# EAGLE design CapHat (EAGLE 7.5.0)
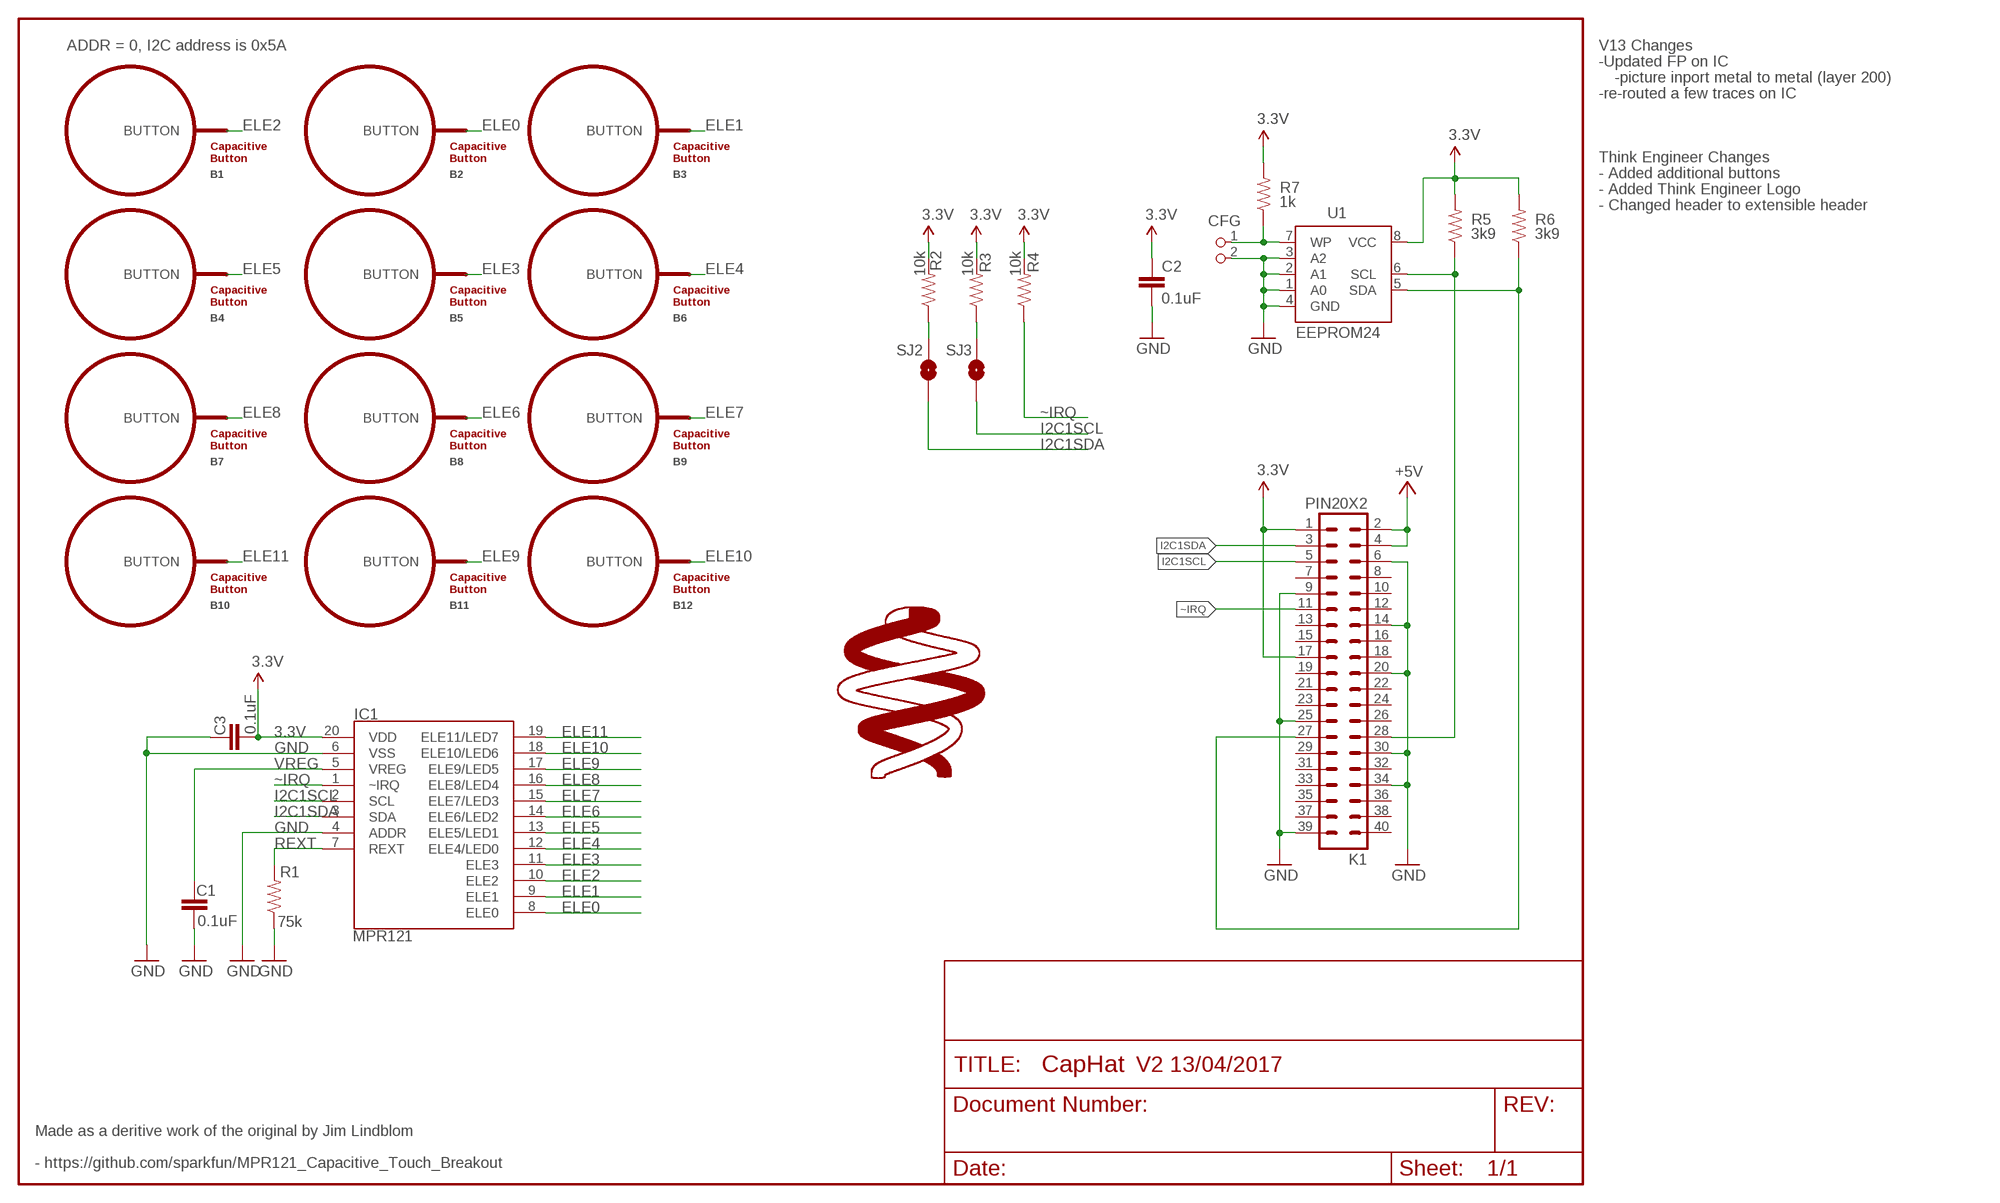
[diagram p0: schematic, sheet 1]

## Parts
B1  BUTTON_PASSIVE10MM  [BUTTON_PASSIVE_10MM]
B2  BUTTON_PASSIVE10MM  [BUTTON_PASSIVE_10MM]
B3  BUTTON_PASSIVE10MM  [BUTTON_PASSIVE_10MM]
B4  BUTTON_PASSIVE10MM  [BUTTON_PASSIVE_10MM]
B5  BUTTON_PASSIVE10MM  [BUTTON_PASSIVE_10MM]
B6  BUTTON_PASSIVE10MM  [BUTTON_PASSIVE_10MM]
B7  BUTTON_PASSIVE10MM  [BUTTON_PASSIVE_10MM]
B8  BUTTON_PASSIVE10MM  [BUTTON_PASSIVE_10MM]
B9  BUTTON_PASSIVE10MM  [BUTTON_PASSIVE_10MM]
B10  BUTTON_PASSIVE10MM  [BUTTON_PASSIVE_10MM]
B11  BUTTON_PASSIVE10MM  [BUTTON_PASSIVE_10MM]
B12  BUTTON_PASSIVE10MM  [BUTTON_PASSIVE_10MM]
C1  0.1uF  CAP0603-CAP  [0603-CAP]
C2  0.1uF  CAP0603-CAP  [0603-CAP]
C3  0.1uF  CAP0603-CAP  [0603-CAP]
CFG  PIN2_100  [PIN_W_2]
IC1  MPR121  MPR121V2  [QFN-20-0.4MM-V2]
K1  PIN20X2  [PIN_20X2]
R1  75k  RESISTOR0603-RES  [0603-RES]
R2  10k  RESISTOR0603-RES  [0603-RES]
R3  10k  RESISTOR0603-RES  [0603-RES]
R4  10k  RESISTOR0603-RES  [0603-RES]
R5  3k9  RESISTOR0603-RES  [0603-RES]
R6  3k9  RESISTOR0603-RES  [0603-RES]
R7  1k  RESISTOR0603-RES  [0603-RES]
SJ2  SOLDERJUMPERNO  [SJ_2S-NO]
SJ3  SOLDERJUMPERNO  [SJ_2S-NO]
U1  EEPROM24  [SOIC8]
U$1  THINK_LOGO  [THINK_LOGO]

## Nets
3.3V: C2.1 C3.2 IC1.20(VDD) K1.1 K1.17 R2.2 R3.2 R4.2 R5.2 R6.2 R7.2 U1.8(VCC)
+5V: K1.2 K1.4
ELE0: B2.BUTTON IC1.8(ELE0)
ELE1: B3.BUTTON IC1.9(ELE1)
ELE2: B1.BUTTON IC1.10(ELE2)
ELE3: B5.BUTTON IC1.11(ELE3)
ELE4: B6.BUTTON IC1.12(ELE4/LED0)
ELE5: B4.BUTTON IC1.13(ELE5/LED1)
ELE6: B8.BUTTON IC1.14(ELE6/LED2)
ELE7: B9.BUTTON IC1.15(ELE7/LED3)
ELE8: B7.BUTTON IC1.16(ELE8/LED4)
ELE9: B11.BUTTON IC1.17(ELE9/LED5)
ELE10: B12.BUTTON IC1.18(ELE10/LED6)
ELE11: B10.BUTTON IC1.19(ELE11/LED7)
GND: C1.2 C2.2 C3.1 CFG.2 IC1.4(ADDR) IC1.6(VSS) K1.6 K1.9 K1.14 K1.20 K1.25 K1.30 K1.34 K1.39 R1.1 U1.1(A0) U1.2(A1) U1.3(A2) U1.4(GND)
I2C1SCL: IC1.2(SCL) K1.5 SJ3.1
I2C1SDA: IC1.3(SDA) K1.3 SJ2.1
N$1: K1.28 R5.1 U1.6(SCL)
N$2: K1.27 R6.1 U1.5(SDA)
N$3: CFG.1 R7.1 U1.7(WP)
REXT: IC1.7(REXT) R1.2
SCL_PU: R3.1 SJ3.2
SDA_PU: R2.1 SJ2.2
VREG: C1.1 IC1.5(VREG)
~IRQ: IC1.1(~IRQ) K1.11 R4.1
Unconnected: K1.7 K1.8 K1.10 K1.12 K1.13 K1.15 K1.16 K1.18 K1.19 K1.21 K1.22 K1.23 K1.24 K1.26 K1.29 K1.31 K1.32 K1.33 K1.35 K1.36 K1.37 K1.38 K1.40

## Notes on the sheet
- ADDR = 0, I2C address is 0x5A | V13 Changes
- -Updated FP on IC
- -picture inport metal to metal (layer 200)
- -re-routed a few traces on IC
- Think Engineer Changes
- - Added additional buttons
- - Added Think Engineer Logo
- - Changed header to extensible header
- V2 13/04/2017
- Made as a deritive work of the original by Jim Lindblom
- - https://github.com/sparkfun/MPR121_Capacitive_Touch_Breakout

## Library data of the parts
B1-B12 = PatternAgents-TouchWidgets:BUTTON_PASSIVE: Button, Passive Capacitive/Touch Sensing Type Source : http://www.PatternAgents.com Github : https://github.com/PatternAgents License : http://creativecommons.org/licenses/by-sa/3.1/ (Creative Commons 3.1) THIS SOFTWARE IS PROVIDED BY THE CONTRIBUTORS "AS IS" AND WITHOUT ANY EXPRESS OR IMPLIED WARRANTIES, INCLUDING, BUT NOT LIMITED TO, THE IMPLIED WARRANTIES OF MERCHANTABILITY AND FITNESS FOR A PARTICULAR PURPOSE ARE DISCLAIMED. IN NO EVENT SHALL THE COPYRIGHT OWNER OR CONTRIBUTORS BE LIABLE FOR ANY DIRECT, INDIRECT, INCIDENTAL, SPECIAL, EXEMPLARY, OR CONSEQUENTIAL DAMAGES (INCLUDING, BUT NOT LIMITED TO, PROCUREMENT OF SUBSTITUTE GOODS OR SERVICES; LOSS OF USE, DATA, OR PROFITS; OR BUSINESS INTERRUPTION) HOWEVER CAUSED AND ON ANY THEORY OF LIABILITY, WHETHER IN CONTRACT, STRICT LIABILITY, OR TORT (INCLUDING NEGLIGENCE OR OTHERWISE) ARISING IN ANY WAY OUT OF THE USE OF THIS SOFTWARE, EVEN IF ADVISED OF THE POSSIBILITY OF SUCH DAMAGE.
C1 C3 = SparkFun-Capacitors:CAP: Capacitor Standard 0603 ceramic capacitor, and 0.1" leaded capacitor.
C2 = SparkFun-Capacitors:CAP: Capacitor Standard 0603 ceramic capacitor, and 0.1" leaded capacitor.; DIELECTRIC: X7R
CFG = FLYFISH:PIN2
IC1 = SparkFun-Sensors:MPR121: MPR121 Capacitive Touch Sensor Controller. Variant "V2" was created using an image import of the bottom of the IC. It matches metal to metal.
K1 = FLYFISH:PIN20X2
R1 = SparkFun-Resistors:RESISTOR: Resistor
R2-R4 = SparkFun:RESISTOR: Resistor
R5-R7 = SparkFun-Resistors:RESISTOR: Resistor; TOLERANCE: 5%
SJ2 SJ3 = SparkFun-Retired:SOLDERJUMPER: Solder Jumper Standard SMD solder jumper. Used to automate production. Two varients : Normally Open and Normally Closed are the same, but have different paste layers. NC will have a large amount of paste and should jumper during reflow.
U1 = FLYFISH:EEPROM24
U$1 = ThinkEngineer:THINK_LOGO

## Board
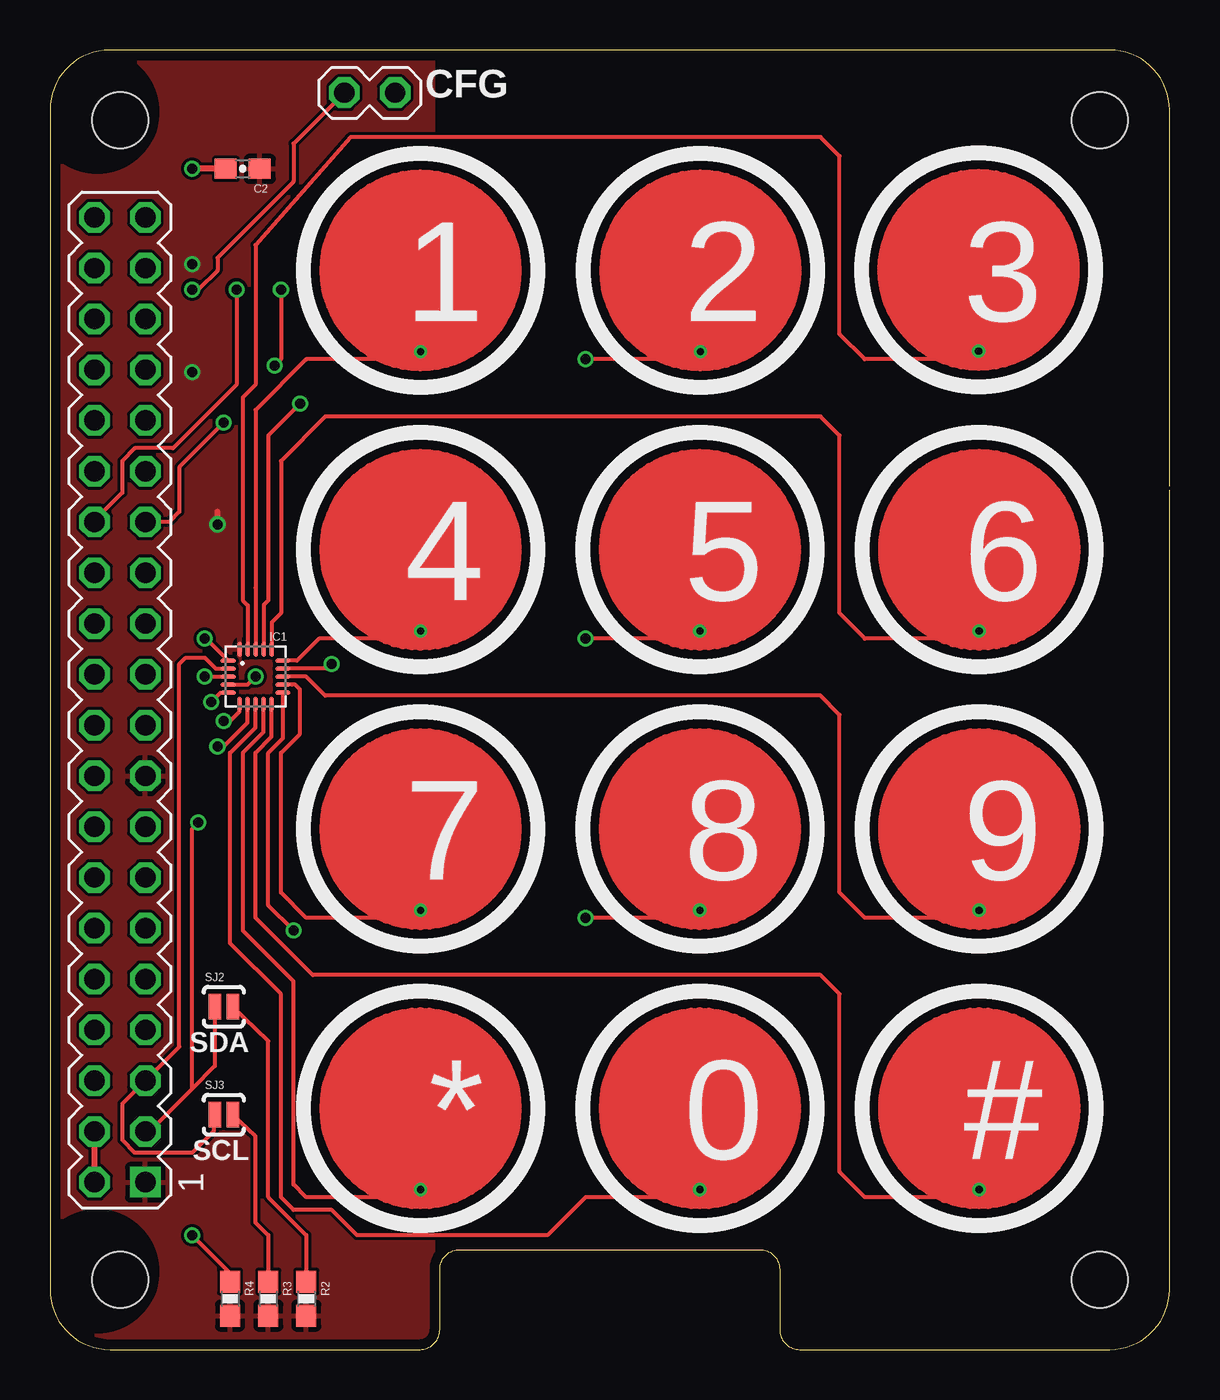
[diagram p1: board, top side]
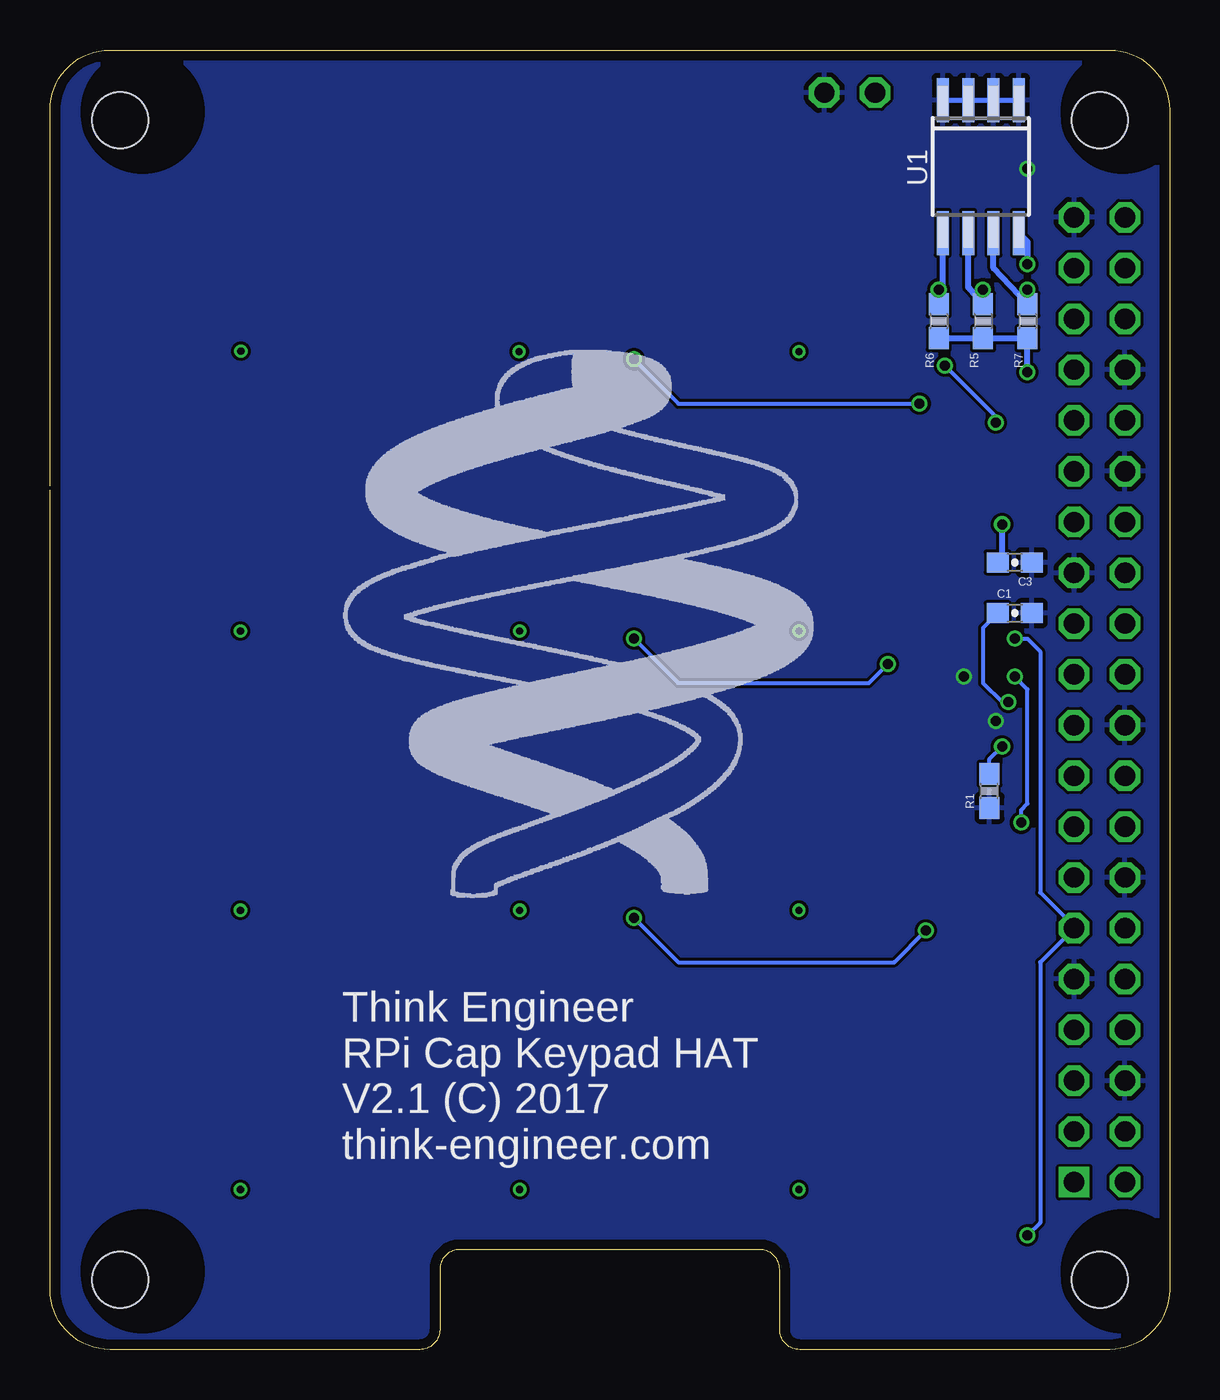
[diagram p2: board, bottom side, seen from below]

Size 56 x 65 mm. Coordinates in mm from the lower left corner, seen from the top.
Outline: 56,43 56,3 arc-90 53,0 37.5,0 arc-90 36.5,1 36.5,4 arc90 35.5,5 20.5,5 arc90 19.5,4 19.5,1 arc-90 18.5,0 3,0 arc-90 0,3 0,62 arc-90 3,65 53,65 arc-90 56,62 56,47
Outline: 56,43.18 56,46.99
Copper layers (1*16): Top 0.035mm / dielectric 1.6mm / Bottom 0.035mm
Design rules "Elecrow_2-layer_PCB_eagle_rule": minimum track width 6mil, minimum drill 12mil, track to track 6mil, track to pad 6mil, pad to pad 6mil, via to via 8mil, smd to smd 0mil, copper to edge 20mil, drill to drill 10mil, minimum pad ring 6mil, minimum via ring 6mil, stop-mask expansion 0mil, vias tented up to drill 100mil, thermal gap 10mil
Holes 2.8 mm at 52.5,3.5 3.5,3.5 3.5,61.5 52.5,61.5
tRestrict: area 49.8,60.4 to 52.9,63.5; area 49.8,2.4 to 52.9,5.5; area 0.8,2.4 to 3.9,5.5; area 0.8,60.4 to 3.9,63.5
bRestrict: area 0.8,60.4 to 3.9,63.5; area 49.8,60.4 to 52.9,63.5; area 0.8,2.4 to 3.9,5.5; area 49.8,2.4 to 52.9,5.5

### Footprints (pad centres in the part's own frame; a part is rotated, then mirrored left to right if it is on the bottom)
BUTTON_PASSIVE_10MM = drill 0.356: BUTTON 0,4.064
0603-CAP = smd 1.1 x 1: 1 -0.85,0; 2 0.85,0
PIN_W_2 = drill 1.016 octagon: 1 0,0; 2 0,-2.54
QFN-20-0.4MM-V2 = smd 0.75 x 0.195: 1 -1.367,0.8; 2 -1.367,0.4; 3 -1.367,0; 4 -1.367,-0.4; 5 -1.367,-0.8; 11 1.375,-0.8; 12 1.375,-0.4; 13 1.375,0; 14 1.375,0.4; 15 1.375,0.8 | smd 0.195 x 0.75: 6 -0.795,-1.372; 7 -0.395,-1.372; 8 0.005,-1.372; 9 0.405,-1.372; 10 0.805,-1.372; 16 0.81,1.372; 17 0.41,1.372; 18 0.01,1.372; 19 -0.39,1.372; 20 -0.79,1.372
PIN_20X2 = drill 1.016 square: 1 -24.13,-1.27 | drill 1.016 octagon: 2 -24.13,1.27; 3 -21.59,-1.27; 4 -21.59,1.27; 5 -19.05,-1.27; 6 -19.05,1.27; 7 -16.51,-1.27; 8 -16.51,1.27; 9 -13.97,-1.27; 10 -13.97,1.27; 11 -11.43,-1.27; 12 -11.43,1.27; 13 -8.89,-1.27; 14 -8.89,1.27; 15 -6.35,-1.27; 16 -6.35,1.27; 17 -3.81,-1.27; 18 -3.81,1.27; 19 -1.27,-1.27; 20 -1.27,1.27; 21 1.27,-1.27; 22 1.27,1.27; 23 3.81,-1.27; 24 3.81,1.27; 25 6.35,-1.27; 26 6.35,1.27; 27 8.89,-1.27; 28 8.89,1.27; 29 11.43,-1.27; 30 11.43,1.27; 31 13.97,-1.27; 32 13.97,1.27; 33 16.51,-1.27; 34 16.51,1.27; 35 19.05,-1.27; 36 19.05,1.27; 37 21.59,-1.27; 38 21.59,1.27; 39 24.13,-1.27; 40 24.13,1.27
0603-RES = smd 1.1 x 1: 1 -0.85,0; 2 0.85,0
SJ_2S-NO = smd 0.635 x 1.27: 1 -0.45,0; 2 0.45,0
SOIC8 = smd 0.6 x 2.2: 1 -1.905,-3.33; 2 -0.635,-3.33; 3 0.635,-3.33; 4 1.905,-3.33; 5 1.905,3.33; 6 0.635,3.33; 7 -0.635,3.33; 8 -1.905,3.33

### Placement (x,y rotation side)
B1  46.48,12.06 180 top
B2  32.5,12.06 180 top
B3  18.53,12.06 180 top
B4  46.48,26.04 180 top
B5  32.5,26.04 180 top
B6  18.53,26.04 180 top
B7  46.48,40.01 180 top
B8  32.5,40.01 180 top
B9  18.53,40.01 180 top
B10  46.45,54 180 top
B11  32.53,53.98 180 top
B12  18.53,53.98 180 top
C1  7.74,36.83 0 bottom
C2  9.64,59.05 180 top
C3  7.74,39.37 180 bottom
CFG  14.72,62.87 90 top
IC1  10.28,33.66 0 top
K1  3.5,32.5 90 top
R1  9.01,27.94 90 bottom
R2  12.82,2.54 270 top
R3  10.92,2.54 270 top
R4  9.01,2.54 270 top
R5  9.33,51.44 270 bottom
R6  11.55,51.44 270 bottom
R7  7.11,51.44 270 bottom
SJ2  8.69,17.14 0 top
SJ3  8.69,11.75 0 top
U1  9.44,59.17 180 bottom
U$1  42.03,21.59 0 bottom

### Tracks (layer width: path | path; a pad name or v marks a point on that pad's centre or on a via)
3.3V  (via drill 0.5)
  Top 0.305: v8.38,41.27 8.38,41.91
  Bottom 0.305: v7.11,48.9 R7.2 R5.2 R6.2 | U1.8 7.11,55.41 v7.11,54.29 | C3.2 8.38,39.59 v8.38,41.27
  pour Top: 19.17,0 -2.42,0 -2.42,66.04 19.17,66.04
+5V
  Top 0.305: K1.2 K1.4
ELE0
  Top 0.203: 32.12,7.62 26.79,7.62 24.88,5.71 15.36,5.71 14.09,6.99 12.19,6.99 11.55,7.62 11.55,17.78 9.01,20.32 9.01,29.84 10.29,31.12 IC1.8
  Top 0.254: B2.BUTTON 32.12,7.62
ELE1
  Top 0.203: 18.15,7.62 12.82,7.62 12.19,8.26 12.19,18.41 9.64,20.95 9.64,29.84 10.69,30.88 IC1.9
  Top 0.254: B3.BUTTON 18.15,7.62
ELE2
  Top 0.203: 46.09,7.62 40.76,7.62 39.49,8.89 39.49,17.78 38.54,18.73 13.14,18.73 10.28,21.59 10.28,29.84 11.09,30.65 IC1.10
  Top 0.254: B1.BUTTON 46.09,7.62
ELE3  (via drill 0.5)
  Top 0.203: B5.BUTTON 32.12,21.59 v26.79,21.59 | v12.19,20.95 10.92,22.22 10.92,29.84 11.65,30.58 IC1.11
  Bottom 0.203: v26.79,21.59 24.57,19.37 13.77,19.37 v12.19,20.95
ELE4
  Top 0.203: B6.BUTTON 18.15,21.59 12.82,21.59 11.55,22.86 11.55,29.84 12.5,30.8 12.5,33.02 12.27,33.26 IC1.12 12.1,33.26
ELE5
  Top 0.203: B4.BUTTON 46.09,21.59 40.76,21.59 39.49,22.86 39.49,31.75 38.54,32.7 13.77,32.7 12.82,33.66 IC1.13
ELE6  (via drill 0.5)
  Top 0.203: B8.BUTTON 32.12,35.56 v26.79,35.56 | v14.09,34.29 13.85,34.05 IC1.14
  Bottom 0.203: v26.79,35.56 24.57,33.34 15.04,33.34 v14.09,34.29
ELE7
  Top 0.203: B9.BUTTON 18.15,35.56 13.46,35.56 12.35,34.46 IC1.15
ELE8
  Top 0.203: B7.BUTTON 46.22,36.2 45.59,35.56 40.76,35.56 39.49,36.83 39.49,45.72 38.54,46.67 13.77,46.67 11.55,44.45 11.55,36.83 11.09,36.37 IC1.16
ELE9  (via drill 0.5)
  Top 0.203: B11.BUTTON 32.15,49.53 v26.79,49.53 | v12.5,47.31 10.92,45.72 10.92,37.47 10.69,37.24 IC1.17
  Bottom 0.203: v26.79,49.53 24.57,47.31 v12.5,47.31
ELE10
  Top 0.203: B12.BUTTON 18.15,49.53 12.82,49.53 10.28,46.99 10.28,38.1 10.29,38.09 IC1.18
ELE11
  Top 0.203: B10.BUTTON 46.04,49.53 40.76,49.53 39.49,50.8 39.49,59.69 38.54,60.64 15.04,60.64 10.28,55.25 10.28,48.26 9.64,47.62 9.64,37.47 9.89,37.22 IC1.19
GND  (via drill 0.5)
  Top 0.203: IC1.6 9.48,31.91 9.01,31.43 v8.69,31.43 | IC1.4 9.88,33.26 v10.28,33.66
  Top 0.305: C2.2 v7.11,59.05
  Bottom 0.254: U1.4 U1.1
  pour Bottom: 53,0 arc90 56,3 56,62 arc90 53,65 3,65 arc90 0,62 0,3 arc90 3,0 18.5,0 arc90 19.5,1 19.5,4 arc-90 20.5,5 35.5,5 arc-90 36.5,4 36.5,1 arc90 37.5,0
I2C1SCL
  Top 0.203: 8.61,34.05 IC1.2 8.29,34.05 7.74,34.61 6.79,34.61 6.47,34.29 6.47,15.15 K1.5 3.61,12.29 3.61,10.48 4.25,9.84 7.11,9.84 8.18,10.92 SJ3.1
I2C1SDA  (via drill 0.5)
  Top 0.203: 7.11,13.04 7.11,26.04 v7.42,26.35 | v7.74,33.66 IC1.3 | SJ2.1 8.24,14.18 7.11,13.04 | 7.11,13.04 4.98,10.91 K1.3
  Bottom 0.203: v7.42,26.35 7.42,26.99 7.11,27.3 7.11,33.02 v7.74,33.66
N$1  (via drill 0.5)
  Top 0.203: v9.33,53.02 9.33,48.26 6.15,45.09 4.25,45.09 3.61,44.45 3.61,42.86 2.23,41.48 K1.28
  Bottom 0.305: U1.6 10.07,53.13 R5.1 v9.33,53.02
N$2  (via drill 0.5)
  Top 0.203: v11.55,53.02 11.55,49.53 v11.23,49.21 | v8.69,46.36 6.47,44.13 6.47,41.91 5.95,41.39 K1.27
  Bottom 0.203: R6.1 v11.55,53.02 | v11.23,49.21 8.69,46.67 v8.69,46.36
  Bottom 0.305: R6.1 11.35,52.59 U1.5
N$3  (via drill 0.5)
  Top 0.203: CFG.1 12.19,60.33 12.19,58.42 8.38,54.61 8.38,53.98 7.42,53.02 v7.11,53.02
  Bottom 0.305: U1.7 8.8,54.09 R7.1 v7.11,53.02
REXT  (via drill 0.5)
  Top 0.203: IC1.7 9.88,31.35 8.69,30.16 v8.38,30.16
  Bottom 0.203: R1.2 9.01,29.53 v8.38,30.16
SCL_PU
  Top 0.203: R3.1 10.92,5.71 10.28,6.35 10.28,10.67 SJ3.2
SDA_PU
  Top 0.203: R2.1 12.82,5.71 10.92,7.62 10.92,15.43 SJ2.2
VREG  (via drill 0.5)
  Top 0.203: v8.06,32.39 8.53,32.86 IC1.5
  Bottom 0.203: C1.1 9.33,36.09 9.33,33.34 8.38,32.39 v8.06,32.39
~IRQ  (via drill 0.5 pad 0.2)
  Top 0.203: v7.74,35.56 7.81,35.56 IC1.1 | R4.1 9.01,3.81 v7.11,5.71
  Bottom 0.203: v7.74,35.56 7.11,35.56 6.47,34.93 6.47,22.86 4.77,21.16 K1.11 6.47,19.37 6.47,6.35 v7.11,5.71

### Text on the board
tNames: 1 | 2 | 3 | 4 | 5 | 6 | 7 | 8 | 9 | SDA | * | 0 | # | SCL
bNames: Think Engineer / RPi Cap Keypad HAT / V2.1 (C) 2017 / think-engineer.com